# EAGLE design V2 (EAGLE 9.5.2)
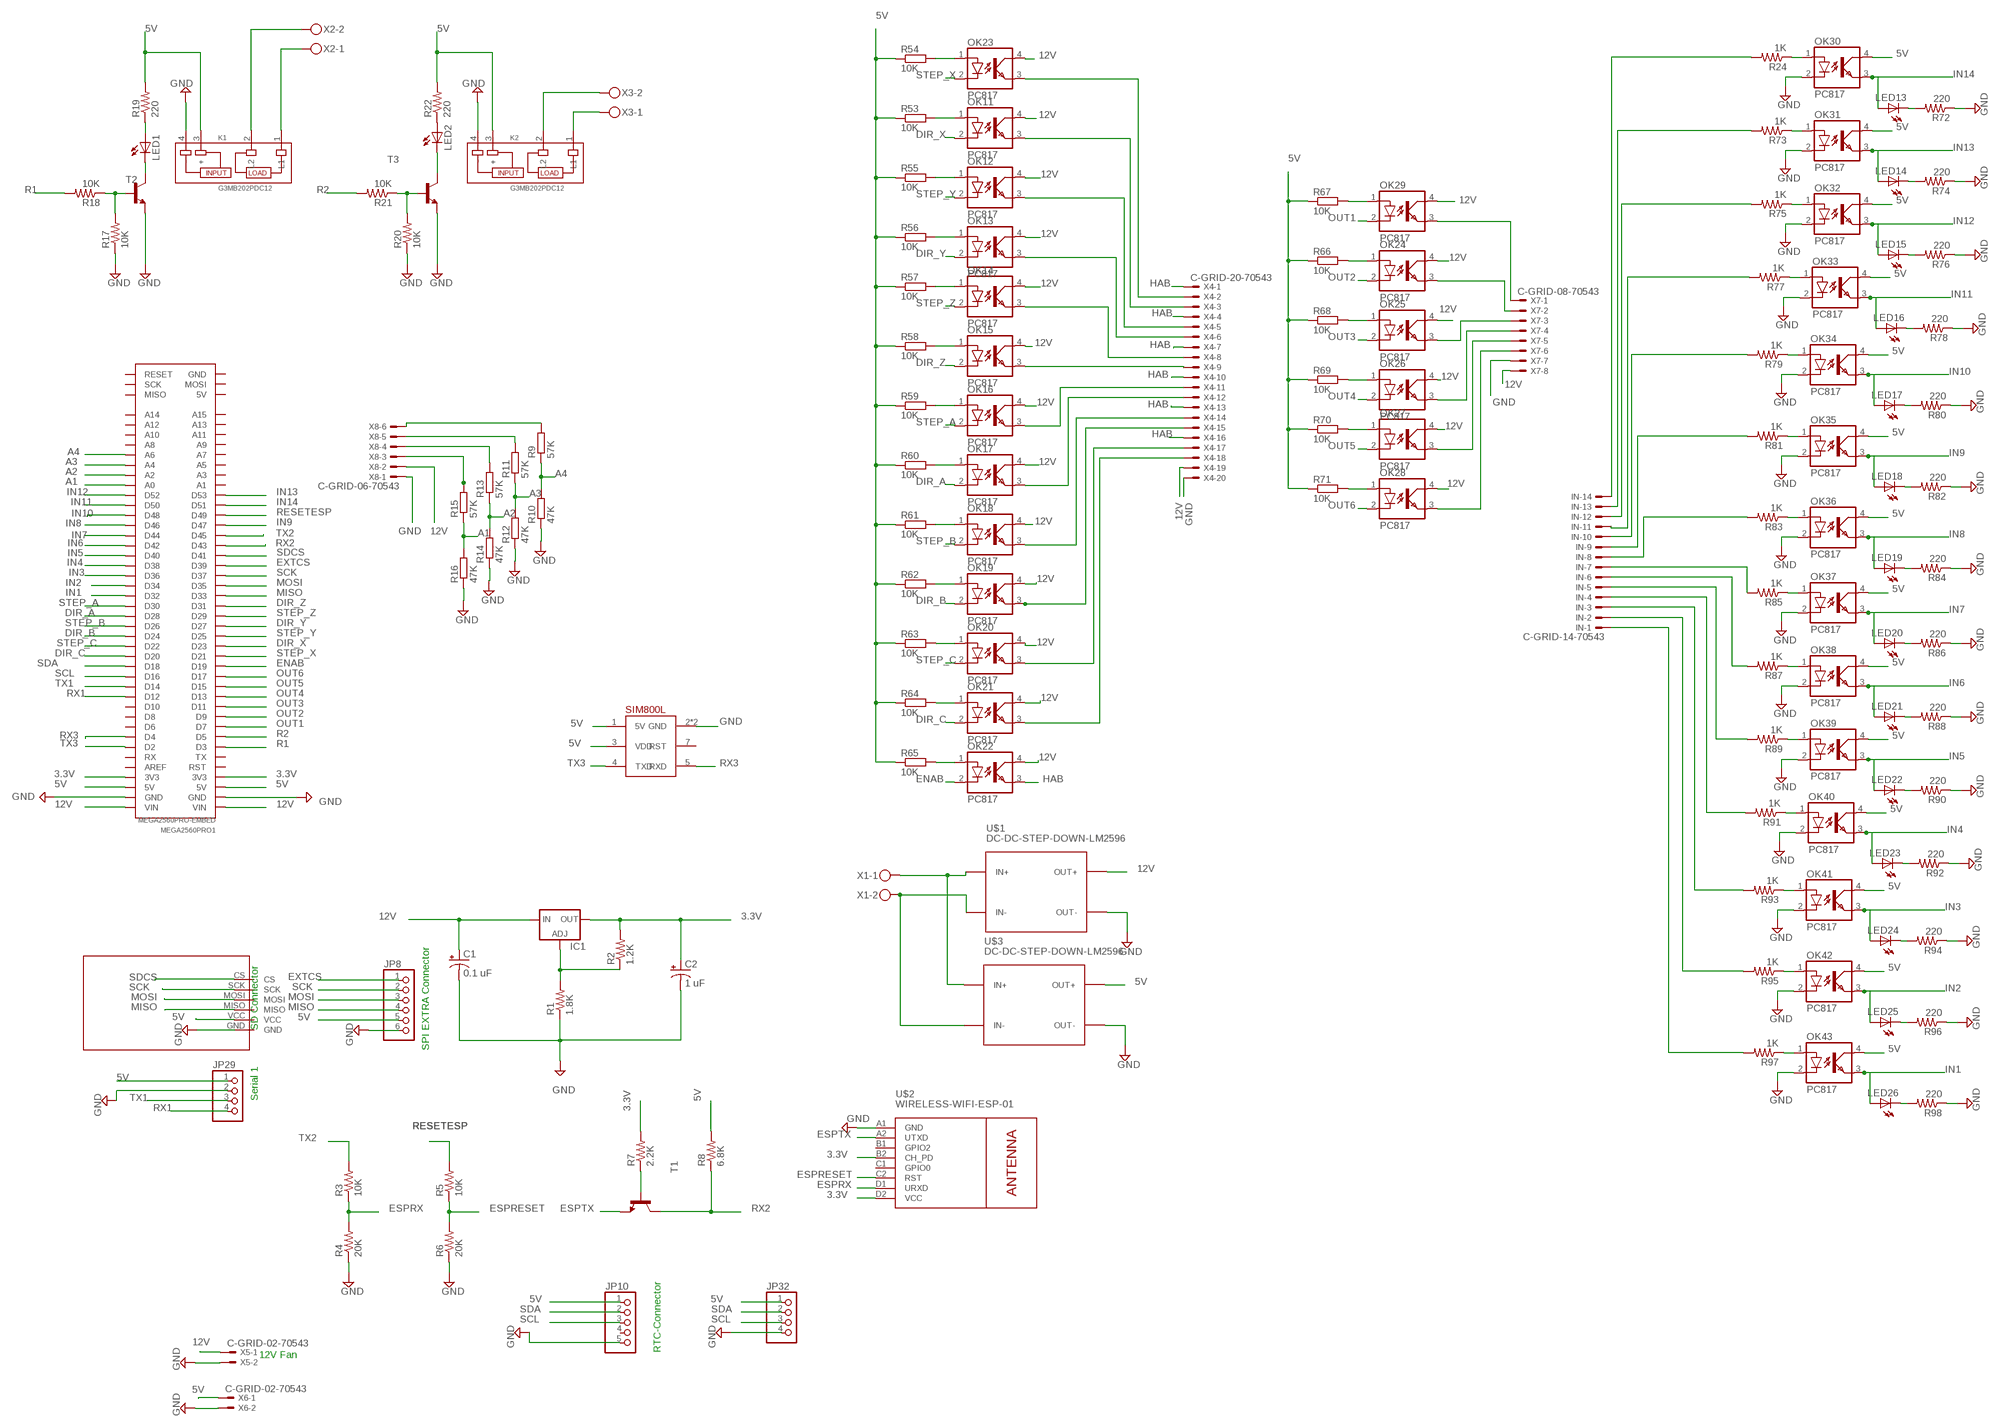
[diagram p0: schematic, sheet 1]

## Parts
C1  0.1 uF  CPOL-USE2.5-7  [E2,5-7]
C2  1 uF  CPOL-USE2.5-7  [E2,5-7]
IC1  LM317TL  [317TL]
IN  C-GRID-14-70543  [70543-14]
JP8  PINHD-1X6  [1X06]
JP10  PINHD-1X5  [1X05]
JP29  PINHD-1X4  [1X04]
JP32  PINHD-1X4  [1X04]
K1  G3MB202PDC12  [RELAY_G3MB202PDC12]
K2  G3MB202PDC12  [RELAY_G3MB202PDC12]
LED1  LED3MM  [LED3MM]
LED2  LED3MM  [LED3MM]
LED13  LED3MM  [LED3MM]
LED14  LED3MM  [LED3MM]
LED15  LED3MM  [LED3MM]
LED16  LED3MM  [LED3MM]
LED17  LED3MM  [LED3MM]
LED18  LED3MM  [LED3MM]
LED19  LED3MM  [LED3MM]
LED20  LED3MM  [LED3MM]
LED21  LED3MM  [LED3MM]
LED22  LED3MM  [LED3MM]
LED23  LED3MM  [LED3MM]
LED24  LED3MM  [LED3MM]
LED25  LED3MM  [LED3MM]
LED26  LED3MM  [LED3MM]
MEGA2560PRO1  MEGA2560PRO-EMBED  [MEGA2560PRO-EMBED]
OK11  PC817  [DIL04]
OK12  PC817  [DIL04]
OK13  PC817  [DIL04]
OK14  PC817  [DIL04]
OK15  PC817  [DIL04]
OK16  PC817  [DIL04]
OK17  PC817  [DIL04]
OK18  PC817  [DIL04]
OK19  PC817  [DIL04]
OK20  PC817  [DIL04]
OK21  PC817  [DIL04]
OK22  PC817  [DIL04]
OK23  PC817  [DIL04]
OK24  PC817  [DIL04]
OK25  PC817  [DIL04]
OK26  PC817  [DIL04]
OK27  PC817  [DIL04]
OK28  PC817  [DIL04]
OK29  PC817  [DIL04]
OK30  PC817  [DIL04]
OK31  PC817  [DIL04]
OK32  PC817  [DIL04]
OK33  PC817  [DIL04]
OK34  PC817  [DIL04]
OK35  PC817  [DIL04]
OK36  PC817  [DIL04]
OK37  PC817  [DIL04]
OK38  PC817  [DIL04]
OK39  PC817  [DIL04]
OK40  PC817  [DIL04]
OK41  PC817  [DIL04]
OK42  PC817  [DIL04]
OK43  PC817  [DIL04]
R1  1.8K  R-US_0207/10  [0207/10]
R2  1.2K  R-US_0207/10  [0207/10]
R3  10K  R-US_0207/10  [0207/10]
R4  20K  R-US_0207/10  [0207/10]
R5  10K  R-US_0207/10  [0207/10]
R6  20K  R-US_0207/10  [0207/10]
R7  2.2K  R-US_0207/10  [0207/10]
R8  6.8K  R-US_0207/10  [0207/10]
R9  57K  R-EU_0207/7  [0207/7]
R10  47K  R-EU_0207/7  [0207/7]
R11  57K  R-EU_0207/7  [0207/7]
R12  47K  R-EU_0207/7  [0207/7]
R13  57K  R-EU_0207/7  [0207/7]
R14  47K  R-EU_0207/7  [0207/7]
R15  57K  R-EU_0207/7  [0207/7]
R16  47K  R-EU_0207/7  [0207/7]
R17  10K  R-US_0207/10  [0207/10]
R18  10K  R-US_0207/10  [0207/10]
R19  220  R-US_0207/10  [0207/10]
R20  10K  R-US_0207/10  [0207/10]
R21  10K  R-US_0207/10  [0207/10]
R22  220  R-US_0207/10  [0207/10]
R24  1K  R-US_0207/10  [0207/10]
R53  10K  R-EU_0207/7  [0207/7]
R54  10K  R-EU_0207/7  [0207/7]
R55  10K  R-EU_0207/7  [0207/7]
R56  10K  R-EU_0207/7  [0207/7]
R57  10K  R-EU_0207/7  [0207/7]
R58  10K  R-EU_0207/7  [0207/7]
R59  10K  R-EU_0207/7  [0207/7]
R60  10K  R-EU_0207/7  [0207/7]
R61  10K  R-EU_0207/7  [0207/7]
R62  10K  R-EU_0207/7  [0207/7]
R63  10K  R-EU_0207/7  [0207/7]
R64  10K  R-EU_0207/7  [0207/7]
R65  10K  R-EU_0207/7  [0207/7]
R66  10K  R-EU_0207/7  [0207/7]
R67  10K  R-EU_0207/7  [0207/7]
R68  10K  R-EU_0207/7  [0207/7]
R69  10K  R-EU_0207/7  [0207/7]
R70  10K  R-EU_0207/7  [0207/7]
R71  10K  R-EU_0207/7  [0207/7]
R72  220  R-US_0207/10  [0207/10]
R73  1K  R-US_0207/10  [0207/10]
R74  220  R-US_0207/10  [0207/10]
R75  1K  R-US_0207/10  [0207/10]
R76  220  R-US_0207/10  [0207/10]
R77  1K  R-US_0207/10  [0207/10]
R78  220  R-US_0207/10  [0207/10]
R79  1K  R-US_0207/10  [0207/10]
R80  220  R-US_0207/10  [0207/10]
R81  1K  R-US_0207/10  [0207/10]
R82  220  R-US_0207/10  [0207/10]
R83  1K  R-US_0207/10  [0207/10]
R84  220  R-US_0207/10  [0207/10]
R85  1K  R-US_0207/10  [0207/10]
R86  220  R-US_0207/10  [0207/10]
R87  1K  R-US_0207/10  [0207/10]
R88  220  R-US_0207/10  [0207/10]
R89  1K  R-US_0207/10  [0207/10]
R90  220  R-US_0207/10  [0207/10]
R91  1K  R-US_0207/10  [0207/10]
R92  220  R-US_0207/10  [0207/10]
R93  1K  R-US_0207/10  [0207/10]
R94  220  R-US_0207/10  [0207/10]
R95  1K  R-US_0207/10  [0207/10]
R96  220  R-US_0207/10  [0207/10]
R97  1K  R-US_0207/10  [0207/10]
R98  220  R-US_0207/10  [0207/10]
T1  29-NPN-TO92-EBC  [TO92-EBC]
T2  29-NPN-TO92-EBC  [TO92-EBC]
T3  29-NPN-TO92-EBC  [TO92-EBC]
U$1  DC-DC-STEP-DOWN-LM2596  [DC-DC-STEP-DOWN-LM2596]
U$2  WIRELESS-WIFI-ESP-01  [WIRELESS-WIFI-ESP-01]
U$3  DC-DC-STEP-DOWN-LM2596  [DC-DC-STEP-DOWN-LM2596]
U$4  SIM800L  [SIP]
U$9  MODULO_SD  [MODULO_SD]
X1  MKDSN1,5/2-5,08  [MKDSN1,5/2-5,08]
X2  MKDSN1,5/2-5,08  [MKDSN1,5/2-5,08]
X3  MKDSN1,5/2-5,08  [MKDSN1,5/2-5,08]
X4  C-GRID-20-70543  [70543-20]
X5  C-GRID-02-70543  [70543-02]
X6  C-GRID-02-70543  [70543-02]
X7  C-GRID-08-70543  [70543-08]
X8  C-GRID-06-70543  [70543-06]

## Nets
3.3V: C2.+ IC1.2(OUT) MEGA2560PRO1.3V3@1(3V3) MEGA2560PRO1.3V3@2(3V3) R2.2 R7.2 U$2.B2(CH_PD) U$2.D2(VCC)
5V: JP8.5 JP10.1 JP29.1 JP32.1 K1.3(+) K2.3(+) MEGA2560PRO1.5V@1(5V) MEGA2560PRO1.5V@2(5V) OK30.4(COL) OK31.4(COL) OK32.4(COL) OK33.4(COL) OK34.4(COL) OK35.4(COL) OK36.4(COL) OK37.4(COL) OK38.4(COL) OK39.4(COL) OK40.4(COL) OK41.4(COL) OK42.4(COL) OK43.4(COL) R8.2 R19.2 R22.2 R53.1 R54.1 R55.1 R56.1 R57.1 R58.1 R59.1 R60.1 R61.1 R62.1 R63.1 R64.1 R65.1 R66.1 R67.1 R68.1 R69.1 R70.1 R71.1 U$3.OUT+ U$4.1(5V) U$4.3(VDD) U$9.VCC X6.1
12V: C1.+ IC1.3(IN) MEGA2560PRO1.VIN@1(VIN) MEGA2560PRO1.VIN@2(VIN) OK11.4(COL) OK12.4(COL) OK13.4(COL) OK14.4(COL) OK15.4(COL) OK16.4(COL) OK17.4(COL) OK18.4(COL) OK19.4(COL) OK20.4(COL) OK21.4(COL) OK22.4(COL) OK23.4(COL) OK24.4(COL) OK25.4(COL) OK26.4(COL) OK27.4(COL) OK28.4(COL) OK29.4(COL) U$1.OUT+ X4.19 X5.1 X7.8 X8.2
A1: MEGA2560PRO1.A0 R15.1 R16.2
A2: MEGA2560PRO1.A2 R13.1 R14.2
A3: MEGA2560PRO1.A4 R11.1 R12.2
A4: MEGA2560PRO1.A6 R9.1 R10.2
DIR_A: MEGA2560PRO1.D28 OK17.2(C)
DIR_B: MEGA2560PRO1.D24 OK19.2(C)
DIR_C: MEGA2560PRO1.D20 OK21.2(C)
DIR_X: MEGA2560PRO1.D23 OK11.2(C)
DIR_Y: MEGA2560PRO1.D27 OK13.2(C)
DIR_Z: MEGA2560PRO1.D31 OK15.2(C)
ENAB: MEGA2560PRO1.D19 OK22.2(C)
ESPRESET: R5.1 R6.2 U$2.C2(RST)
ESPRX: R3.1 R4.2 U$2.D1(URXD)
ESPTX: T1.E U$2.A2(UTXD)
EXTCS: JP8.1 MEGA2560PRO1.D39
GND: C1.- C2.- JP8.6 JP10.5 JP29.2 JP32.4 K1.4(-) K2.4(-) MEGA2560PRO1.GND@1(GND) MEGA2560PRO1.GND@2(GND) OK30.2(C) OK31.2(C) OK32.2(C) OK33.2(C) OK34.2(C) OK35.2(C) OK36.2(C) OK37.2(C) OK38.2(C) OK39.2(C) OK40.2(C) OK41.2(C) OK42.2(C) OK43.2(C) R1.1 R4.1 R6.1 R10.1 R12.1 R14.1 R16.1 R17.1 R20.1 R72.1 R74.1 R76.1 R78.1 R80.1 R82.1 R84.1 R86.1 R88.1 R90.1 R92.1 R94.1 R96.1 R98.1 T2.E T3.E U$1.OUT- U$2.A1(GND) U$3.OUT- U$4.2(GND) U$4.6(GND) U$9.GND X4.20 X5.2 X6.2 X7.7 X8.1
HAB: OK22.3(EMIT) X4.1 X4.4 X4.7 X4.10 X4.13 X4.16
IN1: LED26.A MEGA2560PRO1.D32 OK43.3(EMIT)
IN2: LED25.A MEGA2560PRO1.D34 OK42.3(EMIT)
IN3: LED24.A MEGA2560PRO1.D36 OK41.3(EMIT)
IN4: LED23.A MEGA2560PRO1.D38 OK40.3(EMIT)
IN5: LED22.A MEGA2560PRO1.D40 OK39.3(EMIT)
IN6: LED21.A MEGA2560PRO1.D42 OK38.3(EMIT)
IN7: LED20.A MEGA2560PRO1.D44 OK37.3(EMIT)
IN8: LED19.A MEGA2560PRO1.D46 OK36.3(EMIT)
IN9: LED18.A MEGA2560PRO1.D47 OK35.3(EMIT)
IN10: LED17.A MEGA2560PRO1.D48 OK34.3(EMIT)
IN11: LED16.A MEGA2560PRO1.D50 OK33.3(EMIT)
IN12: LED15.A MEGA2560PRO1.D52 OK32.3(EMIT)
IN13: LED14.A MEGA2560PRO1.D53 OK31.3(EMIT)
IN14: LED13.A MEGA2560PRO1.D51 OK30.3(EMIT)
MISO: JP8.4 MEGA2560PRO1.D33 U$9.MISO
MOSI: JP8.3 MEGA2560PRO1.D35 U$9.MOSI
N$1: K1.1(L1) X2.1
N$2: R7.1 T1.B
N$3: IC1.1(ADJ) R1.2 R2.1
N$4: U$1.IN+ U$3.IN+ X1.1
N$5: U$1.IN- U$3.IN- X1.2
N$6: R17.2 R18.1 T2.B
N$7: LED1.K(C) T2.C
N$8: LED1.A R19.1
N$9: K1.2(L2) X2.2
N$10: K2.1(L1) X3.1
N$11: R20.2 R21.1 T3.B
N$12: LED2.K(C) T3.C
N$13: LED2.A R22.1
N$14: K2.2(L2) X3.2
N$15: OK23.1(A) R54.2
N$16: OK11.1(A) R53.2
N$17: R9.2 X8.6
N$18: OK30.1(A) R24.1
N$19: R11.2 X8.5
N$20: R13.2 X8.4
N$21: R15.2 X8.3
N$22: OK12.1(A) R55.2
N$23: OK29.3(EMIT) X7.1
N$24: OK24.3(EMIT) X7.2
N$25: OK25.3(EMIT) X7.3
N$26: OK13.1(A) R56.2
N$27: OK26.3(EMIT) X7.4
N$28: OK27.3(EMIT) X7.5
N$29: OK28.3(EMIT) X7.6
N$30: OK14.1(A) R57.2
N$31: OK23.3(EMIT) X4.2
N$32: OK11.3(EMIT) X4.3
N$33: OK12.3(EMIT) X4.5
N$34: OK15.1(A) R58.2
N$35: OK13.3(EMIT) X4.6
N$36: OK14.3(EMIT) X4.8
N$37: OK15.3(EMIT) X4.9
N$38: OK16.1(A) R59.2
N$39: OK16.3(EMIT) X4.11
N$40: OK17.3(EMIT) X4.12
N$41: OK18.3(EMIT) X4.14
N$42: OK20.3(EMIT) X4.17
N$43: OK17.1(A) R60.2
N$44: OK21.3(EMIT) X4.18
N$47: OK18.1(A) R61.2
N$51: OK19.1(A) R62.2
N$55: OK20.1(A) R63.2
N$56: OK21.1(A) R64.2
N$57: OK22.1(A) R65.2
N$67: OK19.3(EMIT) X4.15
N$72: OK29.1(A) R67.2
N$73: OK24.1(A) R66.2
N$74: OK25.1(A) R68.2
N$75: OK26.1(A) R69.2
N$76: OK27.1(A) R70.2
N$77: OK28.1(A) R71.2
N$84: LED13.K(C) R72.2
N$85: OK31.1(A) R73.1
N$86: LED14.K(C) R74.2
N$87: OK32.1(A) R75.1
N$88: LED15.K(C) R76.2
N$89: OK33.1(A) R77.1
N$90: LED16.K(C) R78.2
N$91: OK34.1(A) R79.1
N$92: LED17.K(C) R80.2
N$93: OK35.1(A) R81.1
N$94: LED18.K(C) R82.2
N$95: OK36.1(A) R83.1
N$96: LED19.K(C) R84.2
N$97: OK37.1(A) R85.1
N$98: LED20.K(C) R86.2
N$99: OK38.1(A) R87.1
N$100: LED21.K(C) R88.2
N$101: OK39.1(A) R89.1
N$102: LED22.K(C) R90.2
N$103: OK40.1(A) R91.1
N$104: LED23.K(C) R92.2
N$105: OK41.1(A) R93.1
N$106: LED24.K(C) R94.2
N$107: OK42.1(A) R95.1
N$108: LED25.K(C) R96.2
N$109: OK43.1(A) R97.1
N$110: LED26.K(C) R98.2
N$111: IN.14 R24.2
N$112: IN.13 R73.2
N$113: IN.12 R75.2
N$114: IN.11 R77.2
N$115: IN.10 R79.2
N$116: IN.9 R81.2
N$117: IN.8 R83.2
N$118: IN.7 R85.2
N$119: IN.6 R87.2
N$120: IN.5 R89.2
N$121: IN.4 R91.2
N$122: IN.3 R93.2
N$124: IN.2 R95.2
N$125: IN.1 R97.2
OUT1: MEGA2560PRO1.D7 OK29.2(C)
OUT2: MEGA2560PRO1.D9 OK24.2(C)
OUT3: MEGA2560PRO1.D11 OK25.2(C)
OUT4: MEGA2560PRO1.D13 OK26.2(C)
OUT5: MEGA2560PRO1.D15 OK27.2(C)
OUT6: MEGA2560PRO1.D17 OK28.2(C)
R1: MEGA2560PRO1.D3 R18.2
R2: MEGA2560PRO1.D5 R21.2
RESETESP: MEGA2560PRO1.D49 R5.2
RX1: JP29.4 MEGA2560PRO1.D12
RX2: MEGA2560PRO1.D43 R8.1 T1.C
RX3: MEGA2560PRO1.D4 U$4.5(RXD)
SCK: JP8.2 MEGA2560PRO1.D37 U$9.SCK
SCL: JP10.3 JP32.3 MEGA2560PRO1.D16
SDA: JP10.2 JP32.2 MEGA2560PRO1.D18
SDCS: MEGA2560PRO1.D41 U$9.CS
STEP_A: MEGA2560PRO1.D30 OK16.2(C)
STEP_B: MEGA2560PRO1.D26 OK18.2(C)
STEP_C: MEGA2560PRO1.D22 OK20.2(C)
STEP_X: MEGA2560PRO1.D21 OK23.2(C)
STEP_Y: MEGA2560PRO1.D25 OK12.2(C)
STEP_Z: MEGA2560PRO1.D29 OK14.2(C)
TX1: JP29.3 MEGA2560PRO1.D14
TX2: MEGA2560PRO1.D45 R3.2
TX3: MEGA2560PRO1.D2 U$4.4(TXD)
Unconnected: JP10.4 MEGA2560PRO1.5V@3(5V) MEGA2560PRO1.A1 MEGA2560PRO1.A3 MEGA2560PRO1.A5 MEGA2560PRO1.A7 MEGA2560PRO1.A8 MEGA2560PRO1.A9 MEGA2560PRO1.A10 MEGA2560PRO1.A11 MEGA2560PRO1.A12 MEGA2560PRO1.A13 MEGA2560PRO1.A14 MEGA2560PRO1.A15 MEGA2560PRO1.AREF MEGA2560PRO1.D6 MEGA2560PRO1.D8 MEGA2560PRO1.D10 MEGA2560PRO1.GND@3(GND) MEGA2560PRO1.MISO MEGA2560PRO1.MOSI MEGA2560PRO1.RESET MEGA2560PRO1.RST MEGA2560PRO1.RX MEGA2560PRO1.SCK MEGA2560PRO1.TX U$2.B1(GPIO2) U$2.C1(GPIO0) U$4.7(RST)

## Notes on the sheet
- SD Connector
- SPI EXTRA Connector
- Serial 1
- 12V Fan | RTC-Connector

## Library data of the parts
C1 C2 = rcl:CPOL-US: POLARIZED CAPACITOR, American symbol; SPICEPREFIX: C
IC1 = v-reg:LM317TL: VOLTAGE REGULATOR
IN = con-molex:C-GRID-14: CONNECTOR wire to board 2.54 mm (0.100") pitch header; MF: MOLEX; OC_FARNELL: unknown; OC_NEWARK: unknown
JP8 = pinhead:PINHD-1X6: PIN HEADER
JP10 = pinhead:PINHD-1X5: PIN HEADER
JP29 JP32 = pinhead:PINHD-1X4: PIN HEADER
K1 K2 = G3MB202PDC12:G3MB202PDC12: Relay 12vdc Isolation Photot; AVAILABILITY: Unavailable; DESCRIPTION: Solid State SPST-NO _1 Form A_ 4-SIP; MF: Omron Automation; MP: G3MB202PDC12; PACKAGE: SIP-4 Omron Automation; PRICE: None
LED1 LED2 LED13-LED26 = led:LED: LED OSRAM: - CHIPLED LG R971, LG N971, LY N971, LG Q971, LY Q971, LO R971, LY R971 LH N974, LH R974 LS Q976, LO Q976, LY Q976 LO Q996 - Hyper CHIPLED LW Q18S LB Q993, LB Q99A, LB R99A - SideLED LS A670, LO A670, LY A670, LG A670, LP A670 LB A673, LV A673, LT A673, LW A673 LH A674 LY A675 LS A676, LA A676, LO A676, LY A676, LW A676 LS A679, LY A679, LG A679 - Hyper Micro SIDELED® LS Y876, LA Y876, LO Y876, LY Y876 LT Y87S - SmartLED LW L88C, LW L88S LB L89C, LB L89S, LG L890 LS L89K, LO L89K, LY L89K LS L896, LA L896, LO L896, LY L896 - TOPLED LS T670, LO T670, LY T670, LG T670, LP T670 LSG T670, LSP T670, LSY T670, LOP T670, LYG T670 LG T671, LOG T671, LSG T671 LB T673, LV T673, LT T673, LW T673 LH T674 LS T676, LA T676, LO T676, LY T676, LB T676, LH T676, LSB T676, LW T676 LB T67C, LV T67C, LT T67C, LS T67K, LO T67K, LY T67K, LW E67C LS E67B, LA E67B, LO E67B, LY E67B, LB E67C, LV E67C, LT E67C LW T67C LS T679, LY T679, LG T679 LS T770, LO T770, LY T770, LG T770, LP T770 LB T773, LV T773, LT T773, LW T773 LH T774 LS E675, LA E675, LY E675, LS T675 LS T776, LA T776, LO T776, LY T776, LB T776 LHGB T686 LT T68C, LB T68C - Hyper Mini TOPLED® LB M676 - Mini TOPLED Santana® LG M470 LS M47K, LO M47K, LY M47K Source: http://www.osram.convergy.de LUXEON: - LUMILED® LXK2-PW12-R00, LXK2-PW12-S00, LXK2-PW14-U00, LXK2-PW14-V00 LXK2-PM12-R00, LXK2-PM12-S00, LXK2-PM14-U00 LXK2-PE12-Q00, LXK2-PE12-R00, LXK2-PE12-S00, LXK2-PE14-T00, LXK2-PE14-U00 LXK2-PB12-K00, LXK2-PB12-L00, LXK2-PB12-M00, LXK2-PB14-N00, LXK2-PB14-P00, LXK2-PB14-Q00 LXK2-PR12-L00, LXK2-PR12-M00, LXK2-PR14-Q00, LXK2-PR14-R00 LXK2-PD12-Q00, LXK2-PD12-R00, LXK2-PD12-S00 LXK2-PH12-R00, LXK2-PH12-S00 LXK2-PL12-P00, LXK2-PL12-Q00, LXK2-PL12-R00 Source: www.luxeon.com KINGBRIGHT: KA-3528ASYC Source: www.kingbright.com
MEGA2560PRO1 = robotdyn:MEGA2560PRO-EMBED: Robotdyn Robotdyn Mega 2560 PRO (Embed) https://robotdyn.com/mega-2560-pro-embed-ch340g-atmega2560-16au.html
OK11-OK43 = optocoupler:PC817: SHARP OPTO COUPLER; MPN: PC817X4J000F; OC_FARNELL: 9707727; OC_NEWARK: 97K7059
R1-R8 R17-R22 R24 R72-R98 = rcl:R-US_: RESISTOR, American symbol; SPICEPREFIX: R
R9-R16 R53-R71 = rcl:R-EU_: RESISTOR, European symbol; SPICEPREFIX: R
T1-T3 = transistor:*-NPN-: NPN Transistror BF959 corrected 2008.03.06
U$1 U$3 = diy-modules DC-DC modules:DC-DC-STEP-DOWN-LM2596: DC/DC Step-Down Regulator based on LM2596-ADJ chip LM2596 datasheet available here: http://www.ti.com/lit/ds/symlink/lm2596.pdf Click here to find device on ebay.com <http://www.ebay.com/sch/lm2596+power+regulator>
U$2 = ESP 01:WIRELESS-WIFI-ESP-01: Wireless Wi-Fi ESP-01 Module based on ESP8266 chip Click here to find device on ebay.com <http://www.ebay.com/sch/esp8266+esp+01+transceiver>
U$4 = SIM800L:SIM800L: SIM800L Blue EVB Board with Level Translation and diode dropper.
U$9 = modulo_sd:MODULO_SD
X1-X3 = con-phoenix-508:MKDSN1,5/2-5,08: MKDSN 1,5/ 2-5,08 Printklemme Nennstrom: 13,5 A Nennspannung: 250 V Rastermaß: 5,08 mm Polzahl: 2 Anschlussart: Schraubanschluss Montage: Löten Anschlussrichtung Leiter/Platine: 0 ° Artikelnummer: 1729128 Source: http://eshop.phoenixcontact.com .. 1729128.pdf
X4 = con-molex:C-GRID-20: CONNECTOR wire to board 2.54 mm (0.100") pitch header; MF: MOLEX; OC_FARNELL: unknown; OC_NEWARK: unknown
X5 X6 = con-molex:C-GRID-02: CONNECTOR wire to board 2.54 mm (0.100") pitch header; MF: MOLEX; OC_FARNELL: unknown; OC_NEWARK: unknown
X7 = con-molex:C-GRID-08: CONNECTOR wire to board 2.54 mm (0.100") pitch header; MF: MOLEX; OC_FARNELL: unknown; OC_NEWARK: unknown
X8 = con-molex:C-GRID-06: CONNECTOR wire to board 2.54 mm (0.100") pitch header; MF: MOLEX; OC_FARNELL: unknown; OC_NEWARK: unknown

## Net classes
1 my: width 0.6 mm

## Board
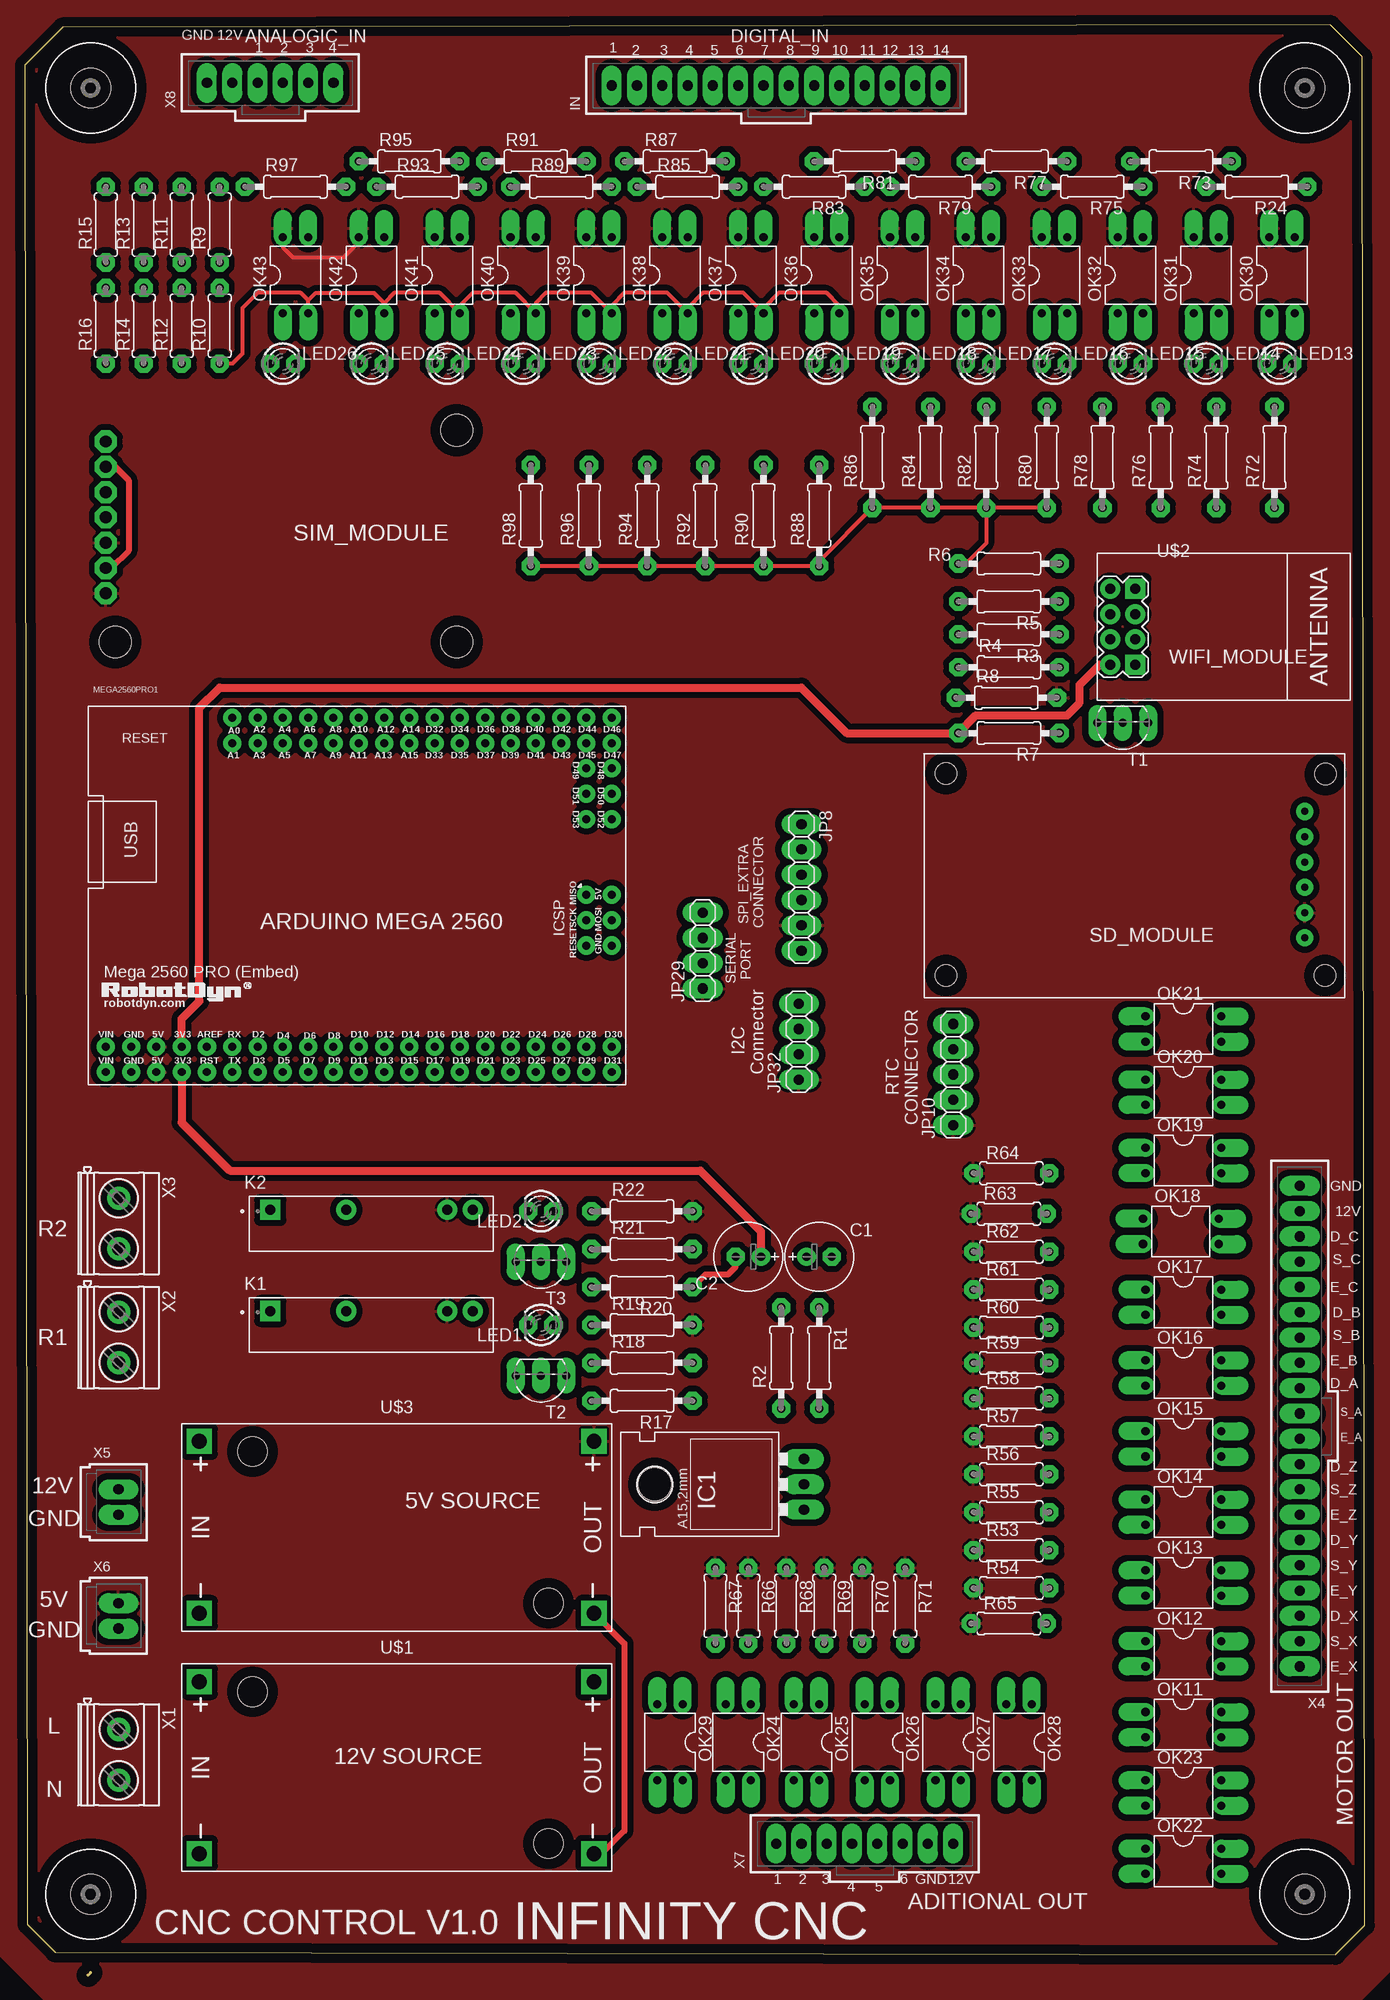
[diagram p1: board, top side]
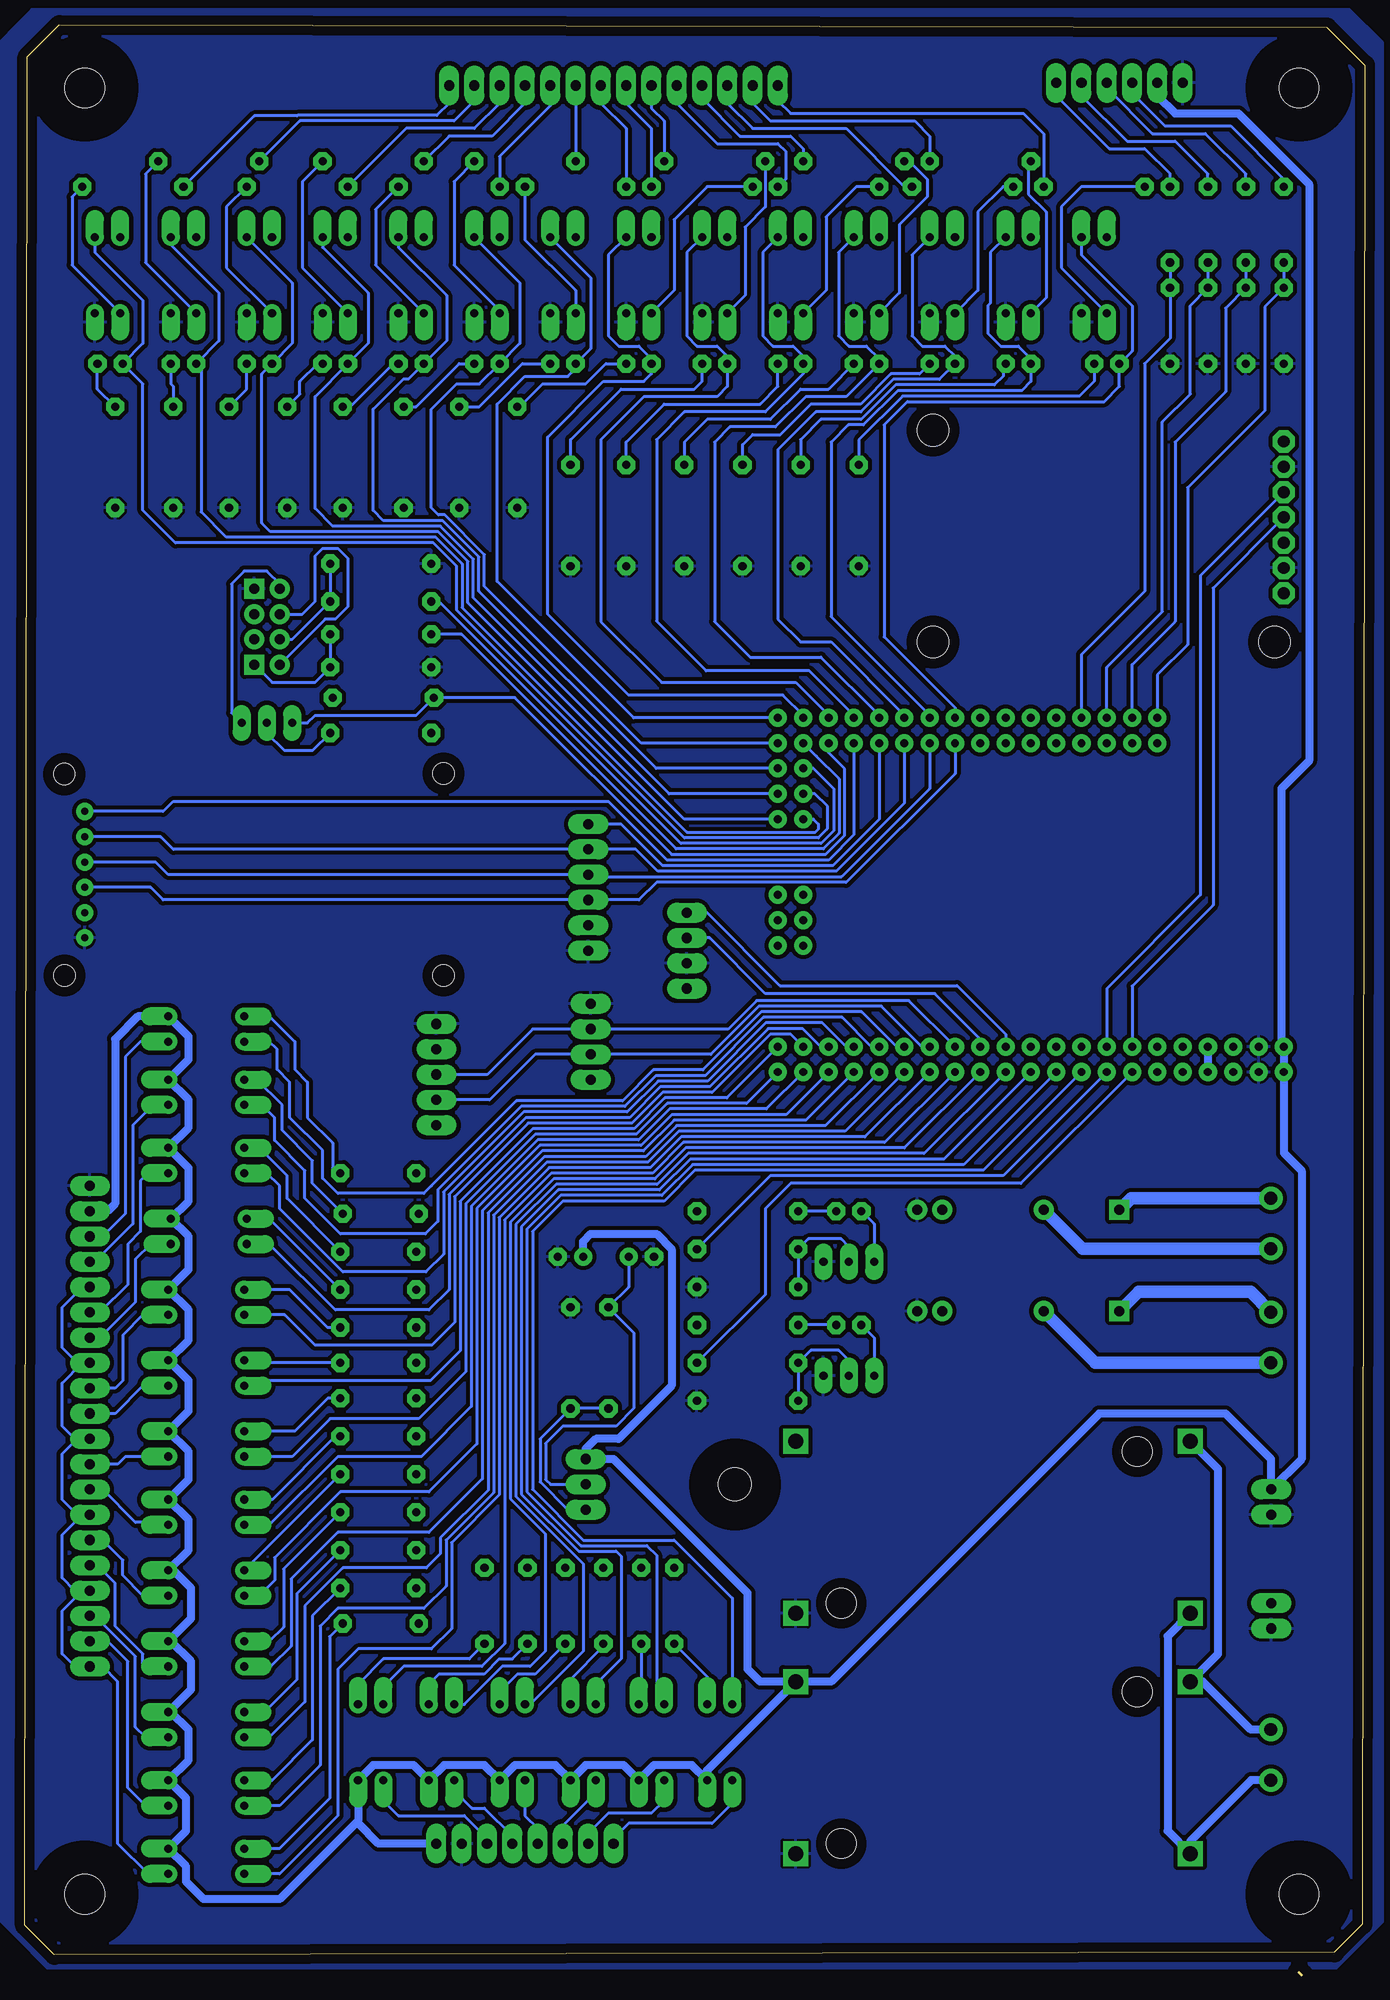
[diagram p2: board, bottom side, seen from below]

Size 134.54 x 195.82 mm. Coordinates in mm from the lower left corner, seen from the top.
Outline: 6.6,0.25 6.35,0
Outline: 0,191.77 0.25,5.08 3.05,2.28 131.57,2.04 134.54,5 134.29,192.61 131.07,195.82 3.8,195.58 0,191.77
Copper layers (1*16): Top 0.035mm / dielectric 1.5mm / Bottom 0.035mm
Design rules "default *": minimum track width 6mil, minimum drill 0.35mm, track to track 10mil, track to pad 10mil, pad to pad 10mil, via to via 10mil, smd to smd 6mil, copper to edge 40mil, drill to drill 6mil, minimum pad ring 20mil, minimum via ring 8mil, stop-mask expansion 4mil, vias tented up to drill 0mil, thermal gap 10mil

### Footprints (pad centres in the part's own frame; a part is rotated, then mirrored left to right if it is on the bottom)
E2,5-7 = drill 0.813 pad 1.6: + -1.27,0 | drill 0.813 pad 1.6 octagon: - 1.27,0
317TL = drill 1.016 long: 1 -2.54,-3.81; 2 0,-3.81; 3 2.54,-3.81 | hole 3.302: 0,11.176
70543-14 = drill 1.016 long: 1 -16.51,0; 2 -13.97,0; 3 -11.43,0; 4 -8.89,0; 5 -6.35,0; 6 -3.81,0; 7 -1.27,0; 8 1.27,0; 9 3.81,0; 10 6.35,0; 11 8.89,0; 12 11.43,0; 13 13.97,0; 14 16.51,0
1X06 = drill 1.016 long: 1 -6.35,0; 2 -3.81,0; 3 -1.27,0; 4 1.27,0; 5 3.81,0; 6 6.35,0
1X05 = drill 1.016 long: 1 -5.08,0; 2 -2.54,0; 3 0,0; 4 2.54,0; 5 5.08,0
1X04 = drill 1.016 long: 1 -3.81,0; 2 -1.27,0; 3 1.27,0; 4 3.81,0
RELAY_G3MB202PDC12 = drill 1 square: 1 -10.16,1.4 | drill 1: 2 -2.54,1.4; 3 7.62,1.4; 4 10.16,1.4
LED3MM = drill 0.813 octagon: A -1.27,0; K 1.27,0
MEGA2560PRO-EMBED = drill 0.8 pad 1.676: 3V3@1 -25.4,-19.05; 3V3@2 -25.4,-16.51; 5V@1 -27.94,-19.05; 5V@2 -27.94,-16.51; 5V@3 17.78,-1.27; A0 -20.32,16.51; A1 -20.32,13.97; A2 -17.78,16.51; A3 -17.78,13.97; A4 -15.24,16.51; A5 -15.24,13.97; A6 -12.7,16.51; A7 -12.7,13.97; A8 -10.16,16.51; A9 -10.16,13.97; A10 -7.62,16.51; A11 -7.62,13.97; A12 -5.08,16.51; A13 -5.08,13.97; A14 -2.54,16.51; A15 -2.54,13.97; AREF -22.86,-16.51; D2 -17.78,-16.51; D3 -17.78,-19.05; D4 -15.24,-16.51; D5 -15.24,-19.05; D6 -12.7,-16.51; D7 -12.7,-19.05; D8 -10.16,-16.51; D9 -10.16,-19.05; D10 -7.62,-16.51; D11 -7.62,-19.05; D12 -5.08,-16.51; D13 -5.08,-19.05; D14 -2.54,-16.51; D15 -2.54,-19.05; D16 0,-16.51; D17 0,-19.05; D18 2.54,-16.51; D19 2.54,-19.05; D20 5.08,-16.51; D21 5.08,-19.05; D22 7.62,-16.51; D23 7.62,-19.05; D24 10.16,-16.51; D25 10.16,-19.05; D26 12.7,-16.51; D27 12.7,-19.05; D28 15.24,-16.51; D29 15.24,-19.05; D30 17.78,-16.51; D31 17.78,-19.05; D32 0,16.51; D33 0,13.97; D34 2.54,16.51; D35 2.54,13.97; D36 5.08,16.51; D37 5.08,13.97; D38 7.62,16.51; D39 7.62,13.97; D40 10.16,16.51; D41 10.16,13.97; D42 12.7,16.51; D43 12.7,13.97; D44 15.24,16.51; D45 15.24,13.97; D46 17.78,16.51; D47 17.78,13.97; D48 17.78,11.43; D49 15.24,11.43; D50 17.78,8.89; D51 15.24,8.89; D52 17.78,6.35; D53 15.24,6.35; GND@1 -30.48,-19.05; GND@2 -30.48,-16.51; GND@3 17.78,-6.35; MISO 15.24,-1.27; MOSI 17.78,-3.81; RESET 15.24,-6.35; RST -22.86,-19.05; RX -20.32,-16.51; SCK 15.24,-3.81; TX -20.32,-19.05; VIN@1 -33.02,-19.05; VIN@2 -33.02,-16.51
DIL04 = drill 0.813 offset: 1 -1.27,-3.81; 2 1.27,-3.81; 3 1.27,3.81; 4 -1.27,3.81
0207/10 = drill 0.813 octagon: 1 -5.08,0; 2 5.08,0
0207/7 = drill 0.813 octagon: 1 -3.81,0; 2 3.81,0
TO92-EBC = drill 0.813 long: B 0,-1.27; C 2.54,-1.27; E -2.54,-1.27
DC-DC-STEP-DOWN-LM2596 = drill 1.5 pad 2.5 square: IN+ -19.812,8.636; IN- -19.812,-8.636; OUT+ 19.812,8.636; OUT- 19.812,-8.636 | hole 3: -14.478,7.62; 15.24,-7.62
WIRELESS-WIFI-ESP-01 = drill 1 square: A1 -8.89,3.81; D1 -8.89,-3.81 | drill 1: A2 -11.43,3.81; B1 -8.89,1.27; B2 -11.43,1.27; C1 -8.89,-1.27; C2 -11.43,-1.27; D2 -11.43,-3.81
SIP = drill 1.2 octagon: 1 38.1,19.24; 2 38.1,16.7; 3 38.1,14.16; 4 38.1,11.62; 5 38.1,9.08; 6 38.1,6.54; 7 38.1,4 | hole 3.2: 2.87,24.13; 2.87,2.87; 37.16,24.13
DRIL-4 = hole 4: 0,0
MODULO_SD = drill 0.7 pad 1.27: CS 0,12.7; GND 0,0; MISO 0,5.08; MOSI 0,7.62; SCK 0,10.16; VCC 0,2.54 | hole 2.15: 2.024,-3.758; 2.061,16.443; -36.026,-3.764; -36.026,16.524
MKDSN1,5/2-5,08 = drill 1.3 pad 2: 1 -2.561,0.025; 2 2.519,0.025
70543-20 = drill 1.016 long: 1 -24.13,0; 2 -21.59,0; 3 -19.05,0; 4 -16.51,0; 5 -13.97,0; 6 -11.43,0; 7 -8.89,0; 8 -6.35,0; 9 -3.81,0; 10 -1.27,0; 11 1.27,0; 12 3.81,0; 13 6.35,0; 14 8.89,0; 15 11.43,0; 16 13.97,0; 17 16.51,0; 18 19.05,0; 19 21.59,0; 20 24.13,0
70543-02 = drill 1.016 long: 1 -1.27,0; 2 1.27,0
70543-08 = drill 1.016 long: 1 -8.89,0; 2 -6.35,0; 3 -3.81,0; 4 -1.27,0; 5 1.27,0; 6 3.81,0; 7 6.35,0; 8 8.89,0
70543-06 = drill 1.016 long: 1 -6.35,0; 2 -3.81,0; 3 -1.27,0; 4 1.27,0; 5 3.81,0; 6 6.35,0

### Placement (x,y rotation side)
C1  79.75,72.14 0 top
C2  72.64,72.14 180 top
IC1  74.42,49.28 90 top
IN  75.43,189.74 0 top
JP8  77.97,109.22 270 top
JP10  93.21,90.42 90 top
JP29  68.07,102.87 90 top
JP32  77.72,93.73 90 top
K1  34.79,65.28 0 top
K2  34.79,75.44 0 top
LED1  51.81,65.28 180 top
LED2  51.81,76.71 180 top
LED13  125.98,161.8 0 top
LED14  118.61,161.8 0 top
LED15  110.99,161.8 0 top
LED16  103.37,161.8 0 top
LED17  95.75,161.8 0 top
LED18  88.13,161.8 0 top
LED19  80.51,161.8 0 top
LED20  72.89,161.8 0 top
LED21  65.27,161.8 0 top
LED22  57.65,161.8 0 top
LED23  50.03,161.8 0 top
LED24  42.41,161.8 0 top
LED25  34.79,161.8 0 top
LED26  25.9,161.8 0 top
MEGA2560PRO1  41.14,109.73 0 top
OK11  116.33,25.15 270 top
OK12  116.33,32.26 270 top
OK13  116.33,39.37 270 top
OK14  116.33,46.48 270 top
OK15  116.33,53.34 270 top
OK16  116.33,60.45 270 top
OK17  116.33,67.56 270 top
OK18  116.07,74.68 270 top
OK19  116.33,81.79 270 top
OK20  116.33,88.65 270 top
OK21  116.33,95 270 top
OK22  116.33,11.43 270 top
OK23  116.33,18.29 270 top
OK24  71.62,23.37 180 top
OK25  78.48,23.37 180 top
OK26  85.59,23.37 180 top
OK27  92.71,23.37 180 top
OK28  99.82,23.37 180 top
OK29  64.77,23.37 180 top
OK30  126.23,170.69 0 top
OK31  118.61,170.69 0 top
OK32  110.99,170.69 0 top
OK33  103.37,170.69 0 top
OK34  95.75,170.69 0 top
OK35  88.13,170.69 0 top
OK36  80.51,170.69 0 top
OK37  72.89,170.69 0 top
OK38  65.27,170.69 0 top
OK39  57.65,170.69 0 top
OK40  50.03,170.69 0 top
OK41  42.41,170.69 0 top
OK42  34.79,170.69 0 top
OK43  27.17,170.69 0 top
R1  79.75,61.98 270 top
R2  75.94,61.98 90 top
R3  98.8,134.62 180 top
R4  98.8,131.32 0 top
R5  98.8,137.92 180 top
R6  98.8,141.73 0 top
R7  98.8,124.71 180 top
R8  98.55,128.27 0 top
R9  19.55,175.77 90 top
R10  19.55,165.61 90 top
R11  15.74,175.77 90 top
R12  15.74,165.61 90 top
R13  11.93,175.77 90 top
R14  11.93,165.61 90 top
R15  8.12,175.77 90 top
R16  8.12,165.61 90 top
R17  61.97,57.66 180 top
R18  61.97,61.47 0 top
R19  61.97,65.28 0 top
R20  61.97,69.09 180 top
R21  61.97,72.9 0 top
R22  61.97,76.71 0 top
R24  123.69,179.58 180 top
R53  99.06,42.67 0 top
R54  99.06,38.86 0 top
R55  99.06,46.48 0 top
R56  99.06,50.29 0 top
R57  99.06,54.1 0 top
R58  99.06,57.91 0 top
R59  99.06,61.47 0 top
R60  99.06,65.02 0 top
R61  99.06,68.83 0 top
R62  99.06,72.64 0 top
R63  98.8,76.45 0 top
R64  99.06,80.52 0 top
R65  98.8,35.31 0 top
R66  72.64,37.08 270 top
R67  69.34,37.08 270 top
R68  76.45,37.08 270 top
R69  80.26,37.08 270 top
R70  84.07,37.08 270 top
R71  88.39,37.08 270 top
R72  125.47,152.4 90 top
R73  116.07,182.12 180 top
R74  119.63,152.4 90 top
R75  107.18,179.58 180 top
R76  114.04,152.4 90 top
R77  99.56,182.12 180 top
R78  108.2,152.4 90 top
R79  91.94,179.58 180 top
R80  102.61,152.4 90 top
R81  84.32,182.12 180 top
R82  96.52,152.4 90 top
R83  79.24,179.58 180 top
R84  90.93,152.4 90 top
R85  66.54,179.58 0 top
R86  85.09,152.4 90 top
R87  65.27,182.12 0 top
R88  79.75,146.56 90 top
R89  53.84,179.58 0 top
R90  74.16,146.56 90 top
R91  51.3,182.12 0 top
R92  68.32,146.56 90 top
R93  40.38,179.58 0 top
R94  62.48,146.56 90 top
R95  38.6,182.12 0 top
R96  56.64,146.56 90 top
R97  27.17,179.58 0 top
R98  50.8,146.56 90 top
T1  110.23,124.46 180 top
T2  51.81,58.93 180 top
T3  51.81,70.36 180 top
U$1  37.33,20.83 0 top
U$2  120.39,135.38 0 top
U$3  37.33,44.96 0 top
U$4  46.22,157.99 180 top
U$5  [DRIL-4]  128.52,189.48 0 top
U$6  [DRIL-4]  6.6,8.13 0 top
U$7  [DRIL-4]  128.52,8.13 0 top
U$8  [DRIL-4]  6.6,189.48 0 top
U$9  128.52,104.14 0 top
X1  9.39,22.1 270 top
X2  9.39,64.01 270 top
X3  9.39,75.44 270 top
X4  128.01,55.12 90 top
X5  9.39,47.5 270 top
X6  9.39,36.07 270 top
X7  84.32,13.21 0 top
X8  24.63,189.99 0 top

### Tracks (layer width: path | path; a pad name or v marks a point on that pad's centre or on a via)
3.3V
  Top 0.813: MEGA2560PRO1.3V3@2 15.74,96.01 17.52,97.79 17.52,127.25 19.55,129.29 77.97,129.29 82.55,124.71 R7.2 95.5,126.49 104.64,126.49 105.91,127.76 105.91,129.54 107.95,131.57 U$2.D2 | MEGA2560PRO1.3V3@1 15.74,85.6 20.57,80.77 67.81,80.77 73.91,74.68 C2.+
  Bottom 0.305: U$2.B2 106.68,136.65 105.41,137.92 105.41,142.49 104.64,143.26 103.12,143.26 102.1,142.24 102.1,137.41 103.37,136.14 104.39,136.14 U$2.D2 | IC1.2 81.76,49.28 82.24,49.76 82.24,53.39 80.51,55.12 75.18,55.12 73.4,56.9 73.4,64.52 R2.2 73.91,69.09 C2.+
  Bottom 0.813: MEGA2560PRO1.3V3@2 MEGA2560PRO1.3V3@1
5V
  Top 0.406: OK43.4 25.9,173.48 26.92,172.47 32,172.47 33.52,173.99 OK42.4
  pour Top (isolate 0.61): -4.07,204.47 137.66,204.47 145.28,196.85 145.28,8.64 133.85,-2.79 132.58,-2.79 132.08,-3.3 2.79,-3.3 -12.96,12.45 -12.96,195.58
12V
  Bottom 0.305: 8.38,93.47 MEGA2560PRO1.VIN@2 | 119.88,26.42 OK11.4 | 119.88,33.53 OK12.4 | 119.63,40.64 OK13.4
  Bottom 0.813: X8.2 20.82,188.72 19.05,186.94 12.7,186.94 5.58,179.83 5.58,121.92 8.38,119.13 8.38,93.47 | MEGA2560PRO1.VIN@2 MEGA2560PRO1.VIN@1 8.12,82.55 6.35,80.77 6.35,51.82 X5.1 9.39,51.82 13.97,56.39 26.67,56.39 53.59,29.46 U$1.OUT+ | U$1.OUT+ 66.04,20.57 OK29.4 67.56,21.08 71.37,21.08 OK24.4 74.42,21.08 78.23,21.08 OK25.4 81.28,21.08 85.34,21.08 OK26.4 88.39,21.08 92.45,21.08 OK27.4 95.5,21.08 99.56,21.08 OK28.4 101.09,15.49 | U$1.OUT+ 60.7,29.46 61.97,30.73 61.97,38.35 75.43,51.82 IC1.3 78.23,52.83 77.21,53.85 74.93,53.85 69.59,59.18 69.59,72.9 71.12,74.42 77.72,74.42 78.48,73.66 C1.+ | 119.88,26.42 118.11,24.64 118.11,21.59 OK23.4 118.36,17.78 118.36,14.48 OK22.4 118.36,10.92 118.36,9.4 116.58,7.62 108.96,7.62 101.09,15.49 | OK11.4 117.85,28.7 117.85,31.5 119.88,33.53 | OK12.4 117.85,35.81 117.85,38.86 119.63,40.64 | OK13.4 118.11,42.67 118.11,45.72 OK14.4 118.11,49.78 118.11,52.58 OK15.4 118.11,56.64 118.11,59.69 OK16.4 118.11,63.75 118.11,66.8 OK17.4 118.11,70.87 118.11,74.17 OK18.4 118.11,77.72 118.11,81.03 OK19.4 118.11,85.09 118.11,87.88 OK20.4 118.11,91.95 118.11,94.23 OK21.4 123.19,96.27 125.47,93.98 125.47,77.47 126.23,76.71 X4.19 | X7.8 99.06,13.21 101.09,15.24 101.09,15.49
A1
  Bottom 0.305: R15.1 R16.2 10.03,167.51 10.03,157.1 17.78,149.35 17.78,133.6 20.82,130.56 MEGA2560PRO1.A0
A2
  Bottom 0.305: R13.1 R14.2 13.97,167.39 13.97,159 19.05,153.92 19.05,135.89 23.36,131.57 MEGA2560PRO1.A2
A3
  Bottom 0.305: MEGA2560PRO1.A4 25.9,131.32 20.32,136.91 20.32,155.96 17.52,158.75 17.52,167.64 R12.2 R11.1
A4
  Bottom 0.305: R9.1 R10.2 19.55,164.34 22.09,161.8 22.09,138.94 28.44,132.59 MEGA2560PRO1.A6
DIR_A
  Bottom 0.305: MEGA2560PRO1.D28 57.65,94.49 59.69,94.49 65.53,88.65 70.5,88.65 73.59,85.55 84.01,85.55 91.38,78.17 91.38,65.53 93.67,63.25 105.41,63.25 108.45,66.29 OK17.2
DIR_B
  Bottom 0.305: MEGA2560PRO1.D24 52.08,93.22 54.47,95.61 60.15,95.61 65.99,89.76 70.96,89.76 74.06,86.67 84.47,86.67 92.5,78.63 92.5,72.39 94.28,70.61 102.61,70.61 108.96,76.96 108.96,79.25 110.23,80.52 OK19.2
DIR_C
  Bottom 0.305: MEGA2560PRO1.D20 47,93.22 50.51,96.72 60.61,96.72 66.45,90.88 71.42,90.88 74.52,87.78 85.19,87.78 93.72,79.25 94.48,78.49 103.12,78.49 104.64,80.01 104.64,82.8 107.95,86.11 107.95,89.66 109.22,90.93 109.22,92.96 109.98,93.73 OK21.2
DIR_X
  Bottom 0.305: MEGA2560PRO1.D23 54.15,85.29 69.11,85.29 72.21,82.19 82.37,82.19 88.03,76.53 88.03,48.67 92.81,43.9 92.81,42.32 94.23,40.89 102.61,40.89 106.42,37.08 106.42,27.43 109.98,23.88 OK11.2
DIR_Y
  Bottom 0.305: MEGA2560PRO1.D27 58.11,86.41 69.57,86.41 72.67,83.31 82.83,83.31 89.15,76.99 89.15,53.34 93.98,48.51 102.87,48.51 109.47,41.91 109.47,39.62 110.99,38.1 OK13.2
DIR_Z
  Bottom 0.305: MEGA2560PRO1.D31 62.07,87.53 70.03,87.53 73.13,84.43 83.29,84.43 90.27,77.45 90.27,60.6 94.99,55.88 103.88,55.88 107.69,52.07 OK15.2
ENAB
  Bottom 0.305: MEGA2560PRO1.D19 50.19,84.18 68.64,84.18 71.74,81.08 81.9,81.08 86.91,76.06 86.91,48.21 91.69,43.43 91.69,34.8 93.72,32.77 101.09,32.77 103.12,30.73 103.12,16 108.96,10.16 OK22.2
ESPRESET
  Bottom 0.305: U$2.C2 107.69,134.11 R5.1 R6.2
ESPRX
  Bottom 0.305: U$2.D1 109.72,129.79 105.41,129.79 R4.2 R3.1
ESPTX
  Bottom 0.305: U$2.A2 108.96,139.7 110.23,140.97 112.52,140.97 113.79,139.7 113.79,126.75 T1.E
EXTCS
  Bottom 0.305: MEGA2560PRO1.D39 48.76,116.05 53.41,111.4 70.51,111.4 74.67,115.57 JP8.1
GND
  Top 0.406: OK36.2 81.78,167.64 80.51,168.91 75.69,168.91 74.16,167.39 OK37.2 72.13,168.91 68.07,168.91 66.54,167.39 OK38.2 64.51,168.91 60.19,168.91 58.92,167.64 OK39.2 56.89,168.91 52.32,168.91 51.3,167.89 OK40.2 49.27,168.91 44.95,168.91 43.68,167.64 OK41.2 41.65,168.91 37.08,168.91 36.06,167.89 | 28.44,168.15 29.21,168.91 35.05,168.91 36.06,167.89 | 36.06,167.89 OK42.2 | OK43.2 28.44,168.15 | 28.44,168.15 27.68,168.91 23.36,168.91 21.84,167.39 21.84,162.81 20.82,161.8 R10.1 | 57.91,12.19 U$1.OUT- | R80.1 R82.1 | R82.1 R84.1 R86.1 79.75,141.99 R88.1 R90.1 R92.1 R94.1 R96.1 R98.1 | R82.1 96.52,143.76 94.48,141.73 R6.1
  Top 0.61: U$4.6 9.08,151.45 10.41,150.11 10.41,143 8.7,141.29 U$4.2 | U$3.OUT- 60.19,33.27 60.19,14.48 57.91,12.19 | R20.1 68.32,70.36 70.61,70.36 71.37,71.12 C2.-
  pour Bottom (isolate 0.406): 1.52,197.36 133.85,197.36 138.68,192.53 138.68,7.11 132.33,0.76 2.79,0.76 -1.78,5.33 -1.78,194.06
HAB
  Bottom 0.305: OK22.3 122.17,10.16 125.22,13.21 125.22,29.46 126.74,30.99 X4.1 129.54,30.99 130.81,32.26 130.81,36.58 128.77,38.61 X4.4 129.54,38.61 130.81,39.88 130.81,44.2 128.77,46.23 X4.7 129.28,46.23 130.81,47.75 130.81,52.32 129.28,53.85 X4.10 129.54,53.85 130.81,55.12 130.81,59.44 128.77,61.47 X4.13 129.28,61.47 130.81,62.99 130.81,67.06 128.77,69.09 X4.16
IN1
  Bottom 0.305: OK43.3 28.44,172.72 23.36,167.64 23.36,163.07 LED26.A 24.63,159.51 26.16,157.99 45.92,157.99 48.26,155.65 48.26,134.37 41.14,127.25 MEGA2560PRO1.D32
IN2
  Bottom 0.305: OK42.3 37.59,172.97 37.59,167.89 37.84,167.64 37.84,164.85 36.57,163.58 34.79,163.58 33.52,162.31 LED25.A 33.52,160.02 34.44,159.11 46.88,159.11 50.34,155.65 51.86,155.65 53.59,153.92 53.59,136.4 43.68,126.49 MEGA2560PRO1.D34
IN3
  Bottom 0.305: OK41.3 45.46,172.72 45.46,164.59 44.45,163.58 42.16,163.58 41.14,162.56 LED24.A 42.72,160.22 47.35,160.22 50.6,156.97 55.11,156.97 58.92,153.16 58.92,136.14 56.64,133.86 53.59,133.86 46.22,126.49 MEGA2560PRO1.D36
IN4
  Bottom 0.305: OK40.3 52.83,172.97 52.83,164.59 51.81,163.58 50.03,163.58 48.76,162.31 LED23.A 52.07,158.5 56.13,158.5 59.18,155.45 63.75,155.45 65.27,153.92 65.27,135.89 61.72,132.33 54.61,132.33 48.76,126.49 MEGA2560PRO1.D38
IN5
  Bottom 0.305: OK39.3 60.45,172.97 60.45,164.59 59.43,163.58 57.4,163.58 56.38,162.56 LED22.A 56.38,160.78 60.19,156.97 68.32,156.97 71.12,154.18 71.12,135.94 66.14,130.96 55.77,130.96 51.3,126.49 MEGA2560PRO1.D40
IN6
  Bottom 0.305: OK38.3 68.07,172.97 68.07,164.59 67.05,163.58 65.02,163.58 64,162.56 LED21.A 64,159.51 65.02,158.5 72.39,158.5 76.7,154.18 76.7,135.89 70.61,129.79 57.15,129.79 53.84,126.49 MEGA2560PRO1.D42
IN7
  Bottom 0.305: OK37.3 75.94,172.72 75.94,164.59 74.93,163.58 72.89,163.58 71.62,162.31 LED20.A 71.62,160.78 72.39,160.02 76.45,160.02 82.04,154.43 82.04,136.65 73.91,128.52 58.42,128.52 56.38,126.49 MEGA2560PRO1.D44
IN8
  Bottom 0.305: OK36.3 77.72,170.43 77.72,163.32 LED19.A 79.24,161.29 80.01,160.53 84.32,160.53 87.12,157.73 87.12,139.95 73.4,126.24 MEGA2560PRO1.D46
IN9
  Bottom 0.305: OK35.3 84.83,169.93 84.83,163.83 LED18.A 88.9,159.77 91.18,159.77 93.72,157.23 93.72,147.32 93.01,146.61 92.36,146.61 88.39,142.63 88.39,139.45 72.64,123.7 MEGA2560PRO1.D47
IN10
  Bottom 0.305: OK34.3 97.02,173.48 92.2,168.66 92.2,164.08 LED17.A 96.01,160.27 96.52,160.27 99.56,157.23 99.56,147.07 98.55,146.05 92.59,146.05 88.95,142.4 88.95,138.96 71.14,121.16 MEGA2560PRO1.D48
IN11
  Bottom 0.305: OK33.3 104.64,173.48 100.07,168.91 100.07,163.83 LED16.A 105.41,158.5 105.41,147.27 103.63,145.49 92.82,145.49 89.51,142.17 89.51,138.28 69.85,118.62 MEGA2560PRO1.D50
IN12
  Bottom 0.305: OK32.3 107.69,169.93 107.69,163.83 LED15.A 110.74,160.78 110.74,145.8 109.88,144.93 93.06,144.93 90.06,141.94 90.06,137.82 68.32,116.08 MEGA2560PRO1.D52
IN13
  Bottom 0.305: OK31.3 119.88,173.74 115.06,168.91 115.06,164.08 LED14.A 116.84,161.29 116.84,146.91 114.3,144.37 93.29,144.37 90.62,141.71 90.62,137.31 68.07,114.76 55.16,114.76 54.86,115.06 54.86,115.57 55.37,116.08 MEGA2560PRO1.D53
IN14
  Bottom 0.305: OK30.3 127.5,172.97 122.68,168.15 122.68,163.83 LED13.A 122.68,159.77 122.68,147.07 119.43,143.81 93.52,143.81 91.18,141.48 91.18,137.06 68.32,114.2 54.86,114.2 53.98,115.08 53.95,115.11 53.95,117.35 55.22,118.62 MEGA2560PRO1.D51
MISO
  Bottom 0.305: MEGA2560PRO1.D33 41.14,120.65 52.07,109.73 71.12,109.73 72.89,107.95 JP8.4 120.65,107.95 121.92,109.22 U$9.MISO
MOSI
  Bottom 0.305: MEGA2560PRO1.D35 43.68,119.13 52.52,110.29 77.77,110.29 JP8.3 120.14,110.49 121.41,111.76 U$9.MOSI
N$1
  Bottom 1.27: X2.1 11.45,68.6 22.71,68.6 K1.1
N$2
  Bottom 0.305: R7.1 105.66,122.94 108.45,122.94 110.23,124.71 T1.B
N$3
  Bottom 0.305: R2.1 R1.2 82.8,53.85 82.8,49.53 80.01,46.74 IC1.1
N$4
  Bottom 0.813: X1.1 11.45,24.66 16.25,29.46 U$1.IN+ 14.73,32.26 14.73,50.8 U$3.IN+
N$5
  Bottom 0.813: X1.2 11.4,19.58 17.52,13.46 U$1.IN- 19.81,14.48 19.81,34.04 U$3.IN-
N$6
  Bottom 0.305: T2.B 51.81,61.72 52.83,62.74 55.62,62.74 R18.1 R17.2
N$7
  Bottom 0.305: LED1.K 49.27,64.01 T2.C
N$8
  Bottom 0.305: LED1.A R19.1
N$9
  Bottom 1.27: X2.2 27.06,61.49 K1.2
N$10
  Bottom 1.27: X3.1 23.47,78 K2.1
N$11
  Bottom 0.305: R20.2 R21.1 55.88,73.91 52.57,73.91 51.81,73.15 T3.B
N$12
  Bottom 0.305: LED2.K 49.27,75.44 T3.C
N$13
  Bottom 0.305: LED2.A R22.1
N$14
  Bottom 1.27: X3.2 28.33,72.92 K2.2
N$15
  Bottom 0.305: R54.2 105.66,36.07 105.66,23.62 109.72,19.56 OK23.1
N$16
  Bottom 0.305: R53.2 107.23,38.3 107.23,29.67 110.49,26.42 OK11.1
N$17
  Bottom 0.305: X8.6 30.98,188.72 25.65,183.39 22.09,183.39 19.55,180.85 R9.2
N$18
  Bottom 0.305: R24.1 129.79,178.56 129.79,171.7 OK30.1
N$19
  Bottom 0.305: R11.2 15.74,180.85 19.05,184.15 23.87,184.15 28.44,188.72 X8.5
N$20
  Bottom 0.305: X8.4 25.9,189.48 21.33,184.91 16,184.91 11.93,180.85 R13.2
N$21
  Bottom 0.305: X8.3 23.36,188.98 20.06,185.67 13.46,185.67 8.12,180.34 R15.2
N$22
  Bottom 0.305: R55.2 108.56,40.79 108.56,34.95 109.98,33.53 OK12.1
N$23
  Bottom 0.305: OK29.3 63.5,17.27 65.53,15.24 73.91,15.24 75.43,13.72 X7.1
N$24
  Bottom 0.305: OK24.3 70.35,17.53 71.62,16.26 75.94,16.26 77.97,14.22 X7.2
N$25
  Bottom 0.305: OK25.3 77.21,18.29 80.51,14.99 X7.3
N$26
  Bottom 0.305: R56.2 OK13.1
N$27
  Bottom 0.305: OK26.3 84.32,16 83.05,14.73 X7.4
N$28
  Bottom 0.305: OK27.3 91.44,18.54 89.66,16.76 88.39,16.76 85.59,13.97 X7.5
N$29
  Bottom 0.305: OK28.3 98.55,17.53 97.02,16 90.42,16 88.13,13.72 X7.6
N$30
  Bottom 0.305: R57.2 103.37,54.1 109.72,47.75 OK14.1
N$31
  Bottom 0.305: OK23.3 122.42,17.02 124.2,18.8 124.2,31.5 126.23,33.53 X4.2
N$32
  Bottom 0.305: OK11.3 122.42,23.88 123.44,24.89 123.44,32 127.5,36.07 X4.3
N$33
  Bottom 0.305: OK12.3 122.42,30.99 122.68,31.24 122.68,32.26 125.47,35.05 125.47,39.37 127.25,41.15 X4.5
N$34
  Bottom 0.305: R58.2 104.14,57.91 107.44,54.61 OK15.1
N$35
  Bottom 0.305: OK13.3 122.68,38.1 124.71,40.13 124.71,41.66 126.74,43.69 X4.6
N$36
  Bottom 0.305: OK14.3 120.39,45.47 123.44,45.47 126.74,48.77 X4.8
N$37
  Bottom 0.305: OK15.3 124.46,52.07 125.22,51.31 X4.9
N$38
  Bottom 0.305: R59.2 112.26,61.47 OK16.1
N$39
  Bottom 0.305: OK16.3 122.68,59.18 125.47,56.39 X4.11
N$40
  Bottom 0.305: OK17.3 122.68,66.29 124.71,64.26 124.71,59.69 125.47,58.93 X4.12
N$41
  Bottom 0.305: OK18.3 121.92,73.41 123.44,71.88 123.44,67.56 127,64.01 X4.14
N$42
  Bottom 0.305: OK20.3 121.66,87.38 123.69,85.34 123.69,75.44 127.5,71.63 X4.17
N$43
  Bottom 0.305: R60.2 104.14,65.02 107.95,68.83 OK17.1
N$44
  Bottom 0.305: OK21.3 122.93,93.73 124.46,92.2 124.46,76.45 126.74,74.17 X4.18
N$47
  Bottom 0.305: R61.2 109.98,75.95 OK18.1
N$51
  Bottom 0.305: R62.2 108.2,77.98 108.2,80.26 110.99,83.06 OK19.1
N$55
  Bottom 0.305: OK20.1 111.25,89.92 108.71,87.38 108.71,84.84 105.66,81.79 105.66,79.5 R63.2
N$56
  Bottom 0.305: OK21.1 109.98,96.27 107.44,93.73 107.44,90.93 106.17,89.66 106.17,86.11 103.63,83.57 103.63,81.03 103.12,80.52 R64.2
N$57
  Bottom 0.305: R65.2 103.93,33.98 103.93,17.76 108.99,12.7 OK22.1
N$67
  Bottom 0.305: OK19.3 122.17,80.52 122.93,79.76 122.93,74.68 124.2,73.41 124.2,69.34 127,66.55 X4.15
N$72
  Bottom 0.305: R67.2 66.04,29.97 OK29.1
N$73
  Bottom 0.305: R66.2 72.64,27.43 OK24.1
N$74
  Bottom 0.305: R68.2 76.45,33.02 79.75,29.72 OK25.1
N$75
  Bottom 0.305: R69.2 83.31,30.23 85.09,30.23 86.61,28.7 86.61,27.43 OK26.1
N$76
  Bottom 0.305: R70.2 85.59,31.75 86.89,31.75 88.42,30.23 92.96,30.23 93.98,29.21 OK27.1
N$77
  Bottom 0.305: R71.2 89.91,31.75 98.55,31.75 101.09,29.21 OK28.1
N$84
  Bottom 0.305: R72.2 127.25,159.26 LED13.K
N$85
  Bottom 0.305: R73.1 122.42,180.85 122.42,171.96 OK31.1
N$86
  Bottom 0.305: R74.2 119.63,159.51 119.88,159.77 LED14.K
N$87
  Bottom 0.305: R75.1 114.3,177.55 114.3,171.45 OK32.1
N$88
  Bottom 0.305: R76.2 112.26,159.26 LED15.K
N$89
  Bottom 0.305: R77.1 106.68,180.09 106.68,171.45 OK33.1
N$90
  Bottom 0.305: R78.2 106.93,158.75 106.93,160.02 105.15,161.8 LED16.K
N$91
  Bottom 0.305: R79.1 99.31,177.29 99.31,171.7 OK34.1
N$92
  Bottom 0.305: R80.2 101.85,157.48 97.53,161.8 LED17.K
N$93
  Bottom 0.305: R81.1 91.44,180.09 91.44,171.7 86.86,167.13 OK35.1
N$94
  Bottom 0.305: R82.2 95.25,157.48 90.93,161.8 LED18.K
N$95
  Bottom 0.305: R83.1 84.32,174.24 79.24,169.16 OK36.1
N$96
  Bottom 0.305: R84.2 88.9,157.48 84.58,161.8 LED19.K
N$97
  Bottom 0.305: R85.1 66.04,179.58 69.34,176.28 69.34,169.16 OK37.1
N$98
  Bottom 0.305: R86.2 84.83,157.48 82.55,159.77 78.23,159.77 76.2,161.8 LED20.K
N$99
  Bottom 0.305: OK38.1 62.23,168.66 62.23,175.51 60.19,177.55 R87.1
N$100
  Bottom 0.305: R88.2 79.75,154.18 74.67,159.26 67.31,159.26 66.54,160.02 LED21.K
N$101
  Bottom 0.305: R89.1 51.05,179.58 54.1,176.53 54.1,169.16 OK39.1
N$102
  Bottom 0.305: R90.2 74.16,153.92 70.35,157.73 60.7,157.73 58.92,159.51 LED22.K
N$103
  Bottom 0.305: R91.1 45.72,182.12 43.94,180.34 43.94,178.56 46.73,175.77 46.73,168.91 OK40.1
N$104
  Bottom 0.305: LED23.K 53.84,159.26 56.64,159.26 59.69,156.21 66.04,156.21 68.32,153.92 R92.2
N$105
  Bottom 0.305: R93.1 36.32,179.58 38.86,177.04 38.86,169.16 OK41.1
N$106
  Bottom 0.305: LED24.K 44.7,160.78 47.58,160.78 50.63,157.73 55.62,157.73 58.67,154.69 61.46,154.69 62.48,153.67 R94.2
N$107
  Bottom 0.305: R95.1 33.78,181.86 33.78,178.82 32,177.04 32,168.4 OK42.1
N$108
  Bottom 0.305: LED25.K 36.32,161.54 36.32,160.53 37.18,159.66 47.12,159.66 50.57,156.21 54.61,156.21 56.64,154.18 R96.2
N$109
  Bottom 0.305: R97.1 28.44,179.58 30.48,177.55 30.48,171.45 OK43.1
N$110
  Bottom 0.305: LED26.K 27.17,160.02 28.65,158.55 46.4,158.55 50.8,154.15 R98.2
N$111
  Bottom 0.305: IN.14 91.94,187.96 93.16,186.74 107.16,186.74 107.21,186.69 111.5,186.69 R24.2
N$112
  Bottom 0.305: IN.13 89.66,189.48 89.66,187.96 91.44,186.18 106.93,186.18 R73.2
N$113
  Bottom 0.305: IN.12 86.86,187.96 89.4,185.42 96.26,185.42 R75.2
N$114
  Bottom 0.305: IN.11 84.32,187.96 87.63,184.66 91.94,184.66 R77.2
N$115
  Bottom 0.305: R79.2 86.86,182.63 81.78,187.71 IN.10
N$116
  Bottom 0.305: IN.9 R81.2
N$117
  Bottom 0.305: IN.8 76.7,187.96 74.16,185.42 R83.2
N$118
  Bottom 0.305: IN.7 74.16,187.96 71.62,185.42 R85.2
N$119
  Bottom 0.305: R87.2 70.35,186.18 71.62,187.45 IN.6
N$120
  Bottom 0.305: IN.5 69.08,187.96 65.02,183.9 58.92,183.9 58.16,183.13 58.16,180.34 R89.2
N$121
  Bottom 0.305: IN.4 66.54,188.47 62.73,184.66 57.65,184.66 56.38,183.39 R91.2
N$122
  Bottom 0.305: IN.3 64,187.96 61.46,185.42 52.07,185.42 46.22,179.58 R93.2
N$124
  Bottom 0.305: IN.2 61.46,187.96 59.69,186.18 45.21,186.18 43.68,184.66 R95.2
N$125
  Bottom 0.305: IN.1 58.92,188.21 57.65,186.94 34.29,186.94 32.25,184.91 R97.2
OUT1
  Bottom 0.305: MEGA2560PRO1.D7 38.3,80.82 67.25,80.82 70.35,77.72 80.51,77.72 83.56,74.68 83.56,48.77 78.48,43.69 69.34,43.69 63.5,37.85 OK29.2
OUT2
  Bottom 0.305: MEGA2560PRO1.D9 40.28,81.38 67.49,81.38 70.58,78.28 80.74,78.28 84.12,74.91 84.12,48.54 78.71,43.13 72.08,43.13 71.12,42.16 71.12,27.94 OK24.2
OUT3
  Bottom 0.305: MEGA2560PRO1.D11 42.26,81.94 67.72,81.94 70.82,78.84 80.98,78.84 84.68,75.14 84.68,48.3 78.94,42.57 75.18,42.57 74.67,42.06 74.67,31.75 77.21,29.21 OK25.2
OUT4
  Bottom 0.305: MEGA2560PRO1.D13 44.24,82.5 67.95,82.5 71.05,79.4 81.21,79.4 85.24,75.37 85.24,48.07 78.48,41.32 78.48,32.51 83.82,27.18 OK26.2
OUT5
  Bottom 0.305: MEGA2560PRO1.D15 46.22,83.06 68.18,83.06 71.28,79.96 81.44,79.96 85.8,75.6 85.8,47.84 82.29,44.34 82.29,32.51 83.82,30.99 86.61,30.99 90.42,27.18 OK27.2
OUT6
  Bottom 0.305: MEGA2560PRO1.D17 48.2,83.62 68.41,83.62 71.51,80.52 81.67,80.52 86.36,75.83 86.36,33.27 88.64,30.99 96.52,30.99 98.55,28.96 OK28.2
R1
  Bottom 0.305: MEGA2560PRO1.D3 34.54,79.5 57.65,79.5 60.19,76.96 60.19,68.33 R18.2
R2
  Bottom 0.305: MEGA2560PRO1.D5 36.32,80.26 59.69,80.26 R21.2
RESETESP
  Bottom 0.305: MEGA2560PRO1.D49 55.37,121.16 53.34,119.13 53.34,114.9 54.6,113.64 68.68,113.64 92.96,137.92 R5.2
RX1
  Bottom 0.305: JP29.4 66.04,106.68 58.72,99.36 40.94,99.36 36.06,94.49 MEGA2560PRO1.D12
RX2
  Bottom 0.305: MEGA2560PRO1.D43 53.84,122.74 52.22,121.11 52.22,114.44 54.13,112.52 69.59,112.52 85.34,128.27 R8.1 95.25,126.49 105.41,126.49 106.17,125.73 T1.C
RX3
  Bottom 0.305: U$4.5 16.51,140.53 16.51,108.46 25.9,99.06 MEGA2560PRO1.D4
SCK
  Bottom 0.305: MEGA2560PRO1.D37 46.22,117.68 53.06,110.85 70.99,110.85 73.18,113.03 JP8.2 119.63,113.03 120.9,114.3 U$9.SCK
SCL
  Bottom 0.305: MEGA2560PRO1.D16 45.77,97.84 61.07,97.84 63.92,95 JP32.3 83.56,95 88.13,90.42 JP10.3
SDA
  Bottom 0.305: MEGA2560PRO1.D18 44.46,93.22 48.53,97.28 60.84,97.28 65.67,92.46 JP32.2 83.31,92.46 87.88,87.88 JP10.2
SDCS
  Bottom 0.305: MEGA2560PRO1.D41 51.3,114.5 53.84,111.96 70.05,111.96 75.94,117.86 119.63,117.86 120.65,116.84 U$9.CS
STEP_A
  Bottom 0.305: MEGA2560PRO1.D30 64.05,88.09 70.26,88.09 73.36,84.99 83.52,84.99 90.83,77.69 90.83,62.67 93.81,59.69 112.01,59.69 OK16.2
STEP_B
  Bottom 0.305: MEGA2560PRO1.D26 54.62,93.22 56.45,95.05 59.92,95.05 65.76,89.2 70.73,89.2 73.83,86.11 84.24,86.11 91.94,78.4 91.94,68.83 93.98,66.8 103.37,66.8 109.98,73.41 OK18.2
STEP_C
  Bottom 0.305: MEGA2560PRO1.D22 49.54,93.22 52.49,96.16 60.38,96.16 66.22,90.32 71.19,90.32 74.29,87.22 84.7,87.22 93.06,78.86 93.06,75.69 94.33,74.42 102.87,74.42 106.42,77.98 106.42,80.77 109.47,83.82 109.47,86.11 110.74,87.38 OK20.2
STEP_X
  Bottom 0.305: MEGA2560PRO1.D21 52.17,84.73 68.87,84.73 71.97,81.64 82.13,81.64 87.47,76.3 87.47,48.44 92.25,43.66 92.25,39.06 94.48,36.83 103.12,36.83 104.9,35.05 104.9,21.08 108.96,17.02 OK23.2
STEP_Y
  Bottom 0.305: MEGA2560PRO1.D25 56.13,85.85 69.34,85.85 72.44,82.75 82.6,82.75 88.59,76.76 88.59,49.84 93.98,44.45 103.12,44.45 107.79,39.78 107.79,33.02 109.83,30.99 OK12.2
STEP_Z
  Bottom 0.305: MEGA2560PRO1.D29 60.09,86.97 69.8,86.97 72.9,83.87 83.06,83.87 89.71,77.22 89.71,57.1 94.74,52.07 103.12,52.07 109.98,45.21 OK14.2
TX1
  Bottom 0.305: JP29.3 65.78,104.14 60.19,98.55 43.18,98.55 38.6,93.98 MEGA2560PRO1.D14
TX2
  Bottom 0.305: MEGA2560PRO1.D45 55.09,122.4 55.06,122.4 52.78,120.12 52.78,114.67 54.37,113.08 69.13,113.08 90.67,134.62 R3.2
TX3
  Bottom 0.305: U$4.4 15.24,139.26 15.24,107.44 23.36,99.31 MEGA2560PRO1.D2

### Text on the board
tPlace: GND | 12V | ANALOGIC_IN | DIGITAL_IN | 1 | 2 | 3 | 4 | 1 | 2 | 3 | 4 | 5 | 6 | 7 | 8 | 9 | 10 | 11 | 12 | 13 | 14 | SIM_MODULE | WIFI_MODULE | ARDUINO MEGA 2560 | SPI_EXTRA / CONNECTOR | SD_MODULE | SERIAL / PORT | I2C / Connector | RTC / CONNECTOR | GND | 12V | R2 | D_C | S_C | E_C | D_B | S_B | R1 | E_B | D_A | S_A | E_A | 12V | D_Z | 5V SOURCE | S_Z | GND | E_Z | D_Y | S_Y | 5V | E_Y | GND | D_X | S_X | E_X | L | 12V SOURCE | N | MOTOR OUT | 1 | 2 | 3 | 6 | GND | 12V | 4 | 5 | ADITIONAL OUT | CNC CONTROL V1.0 | INFINITY CNC